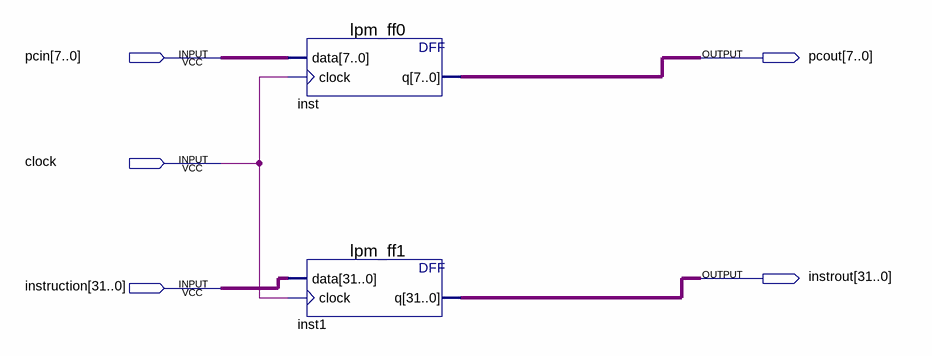
[diagram p0: schematic sheet]
// Quartus schematic fetchstore.bdf as structural Verilog: 2 symbols, 5 pins
module fetchstore (
  input  [7:0] pcin,
  input  clock,
  input  [31:0] instruction,
  output [7:0] pcout,
  output [31:0] instrout
);

  lpm_ff0 inst (.data(pcin), .clock(clock), .q(pcout));
  lpm_ff1 inst1 (.data(instruction), .clock(clock), .q(instrout));
endmodule
